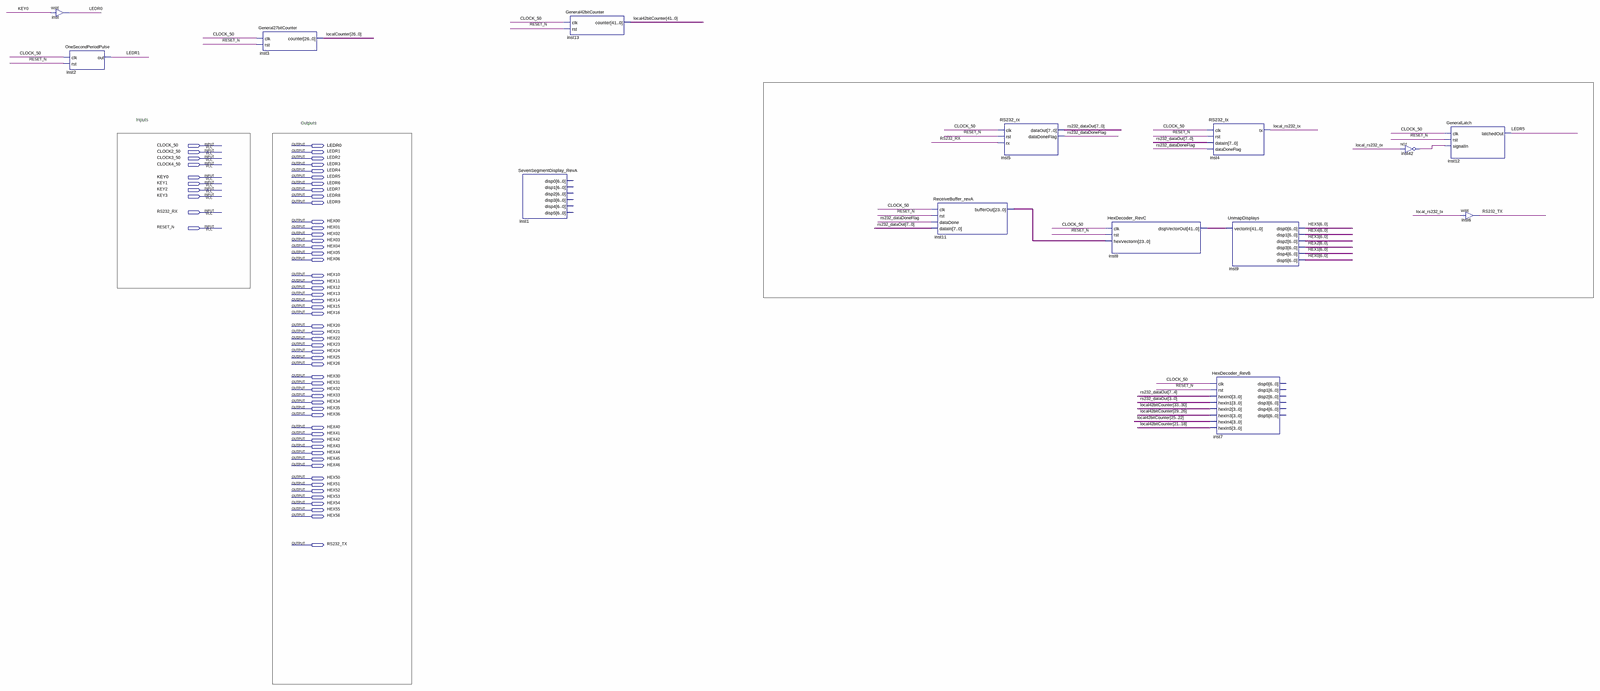
[diagram p0: schematic sheet, whole]
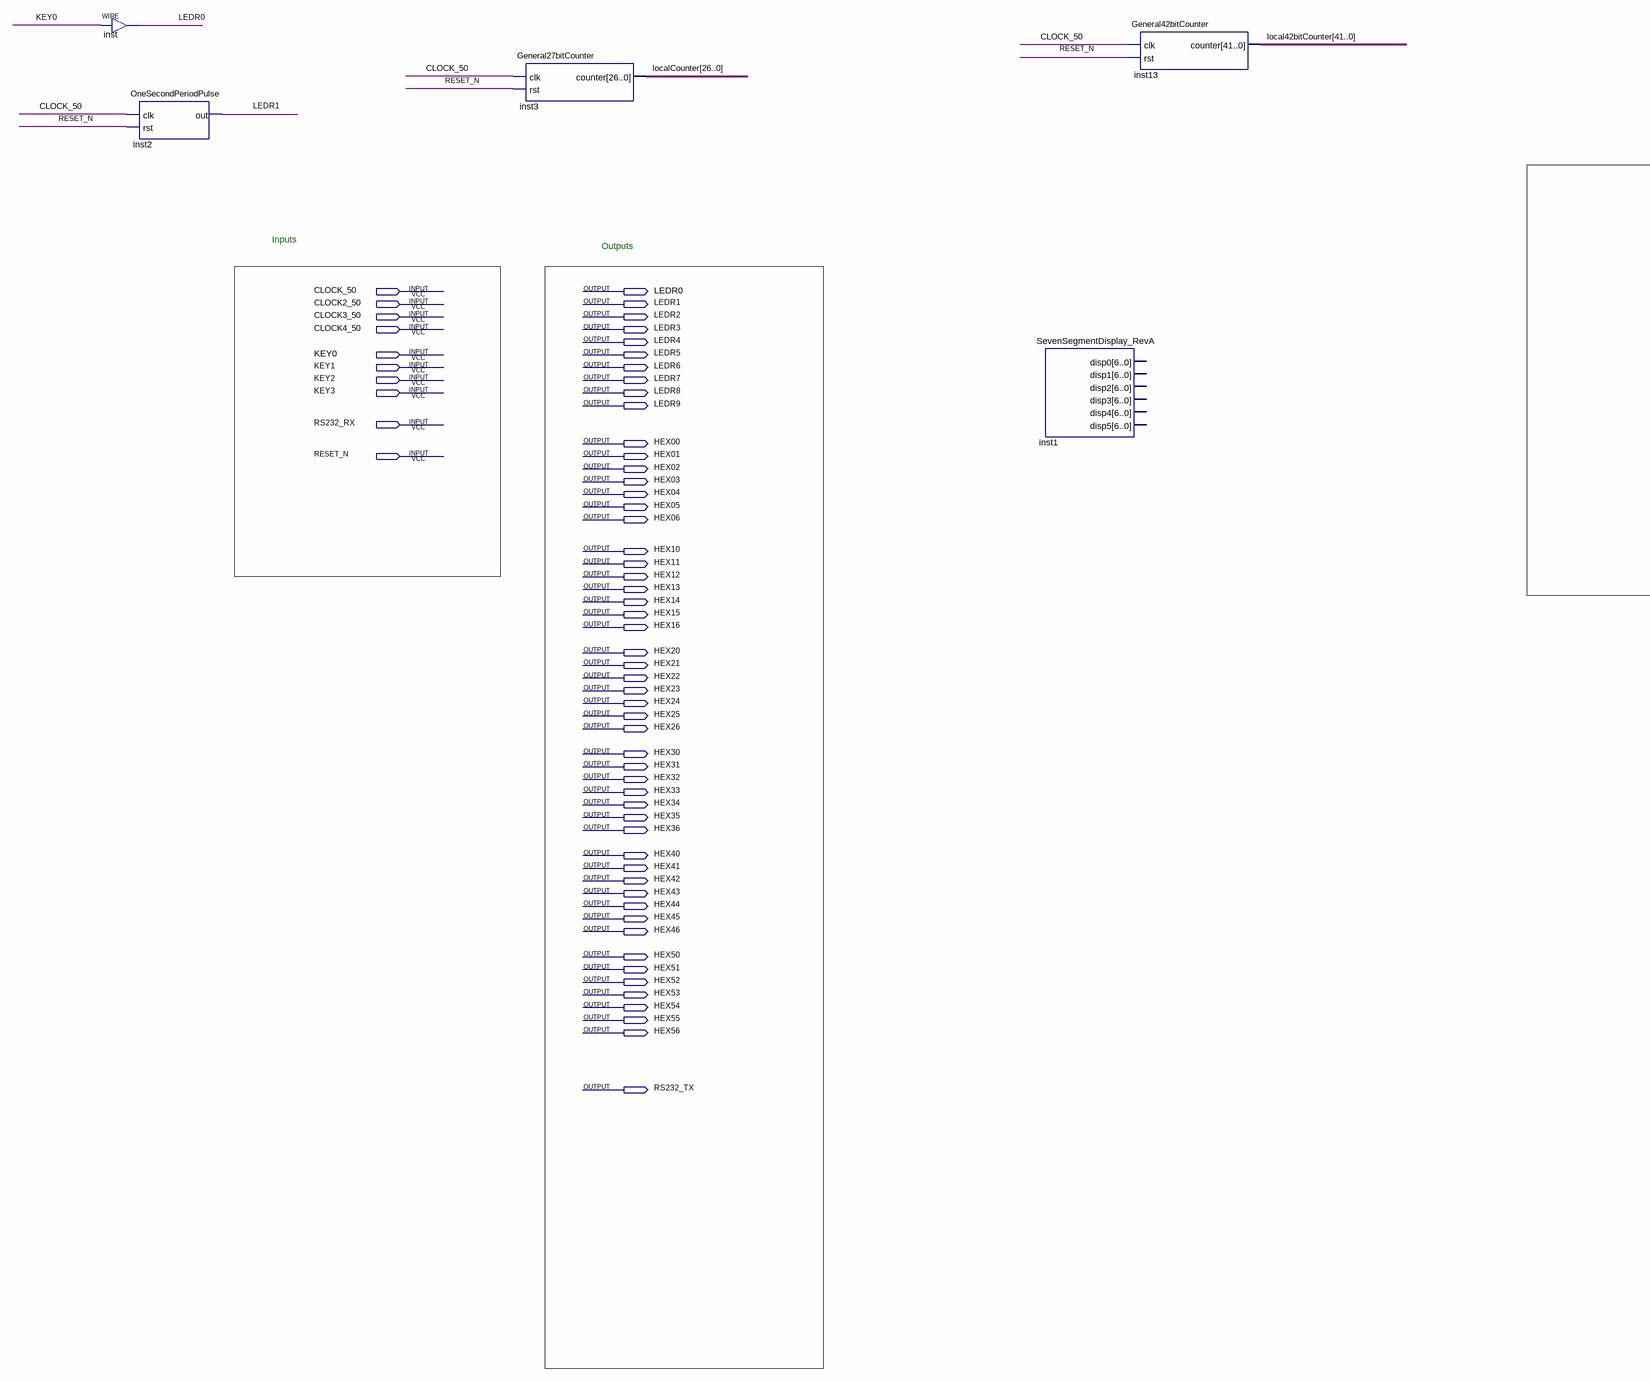
[diagram p1: schematic sheet, left part]
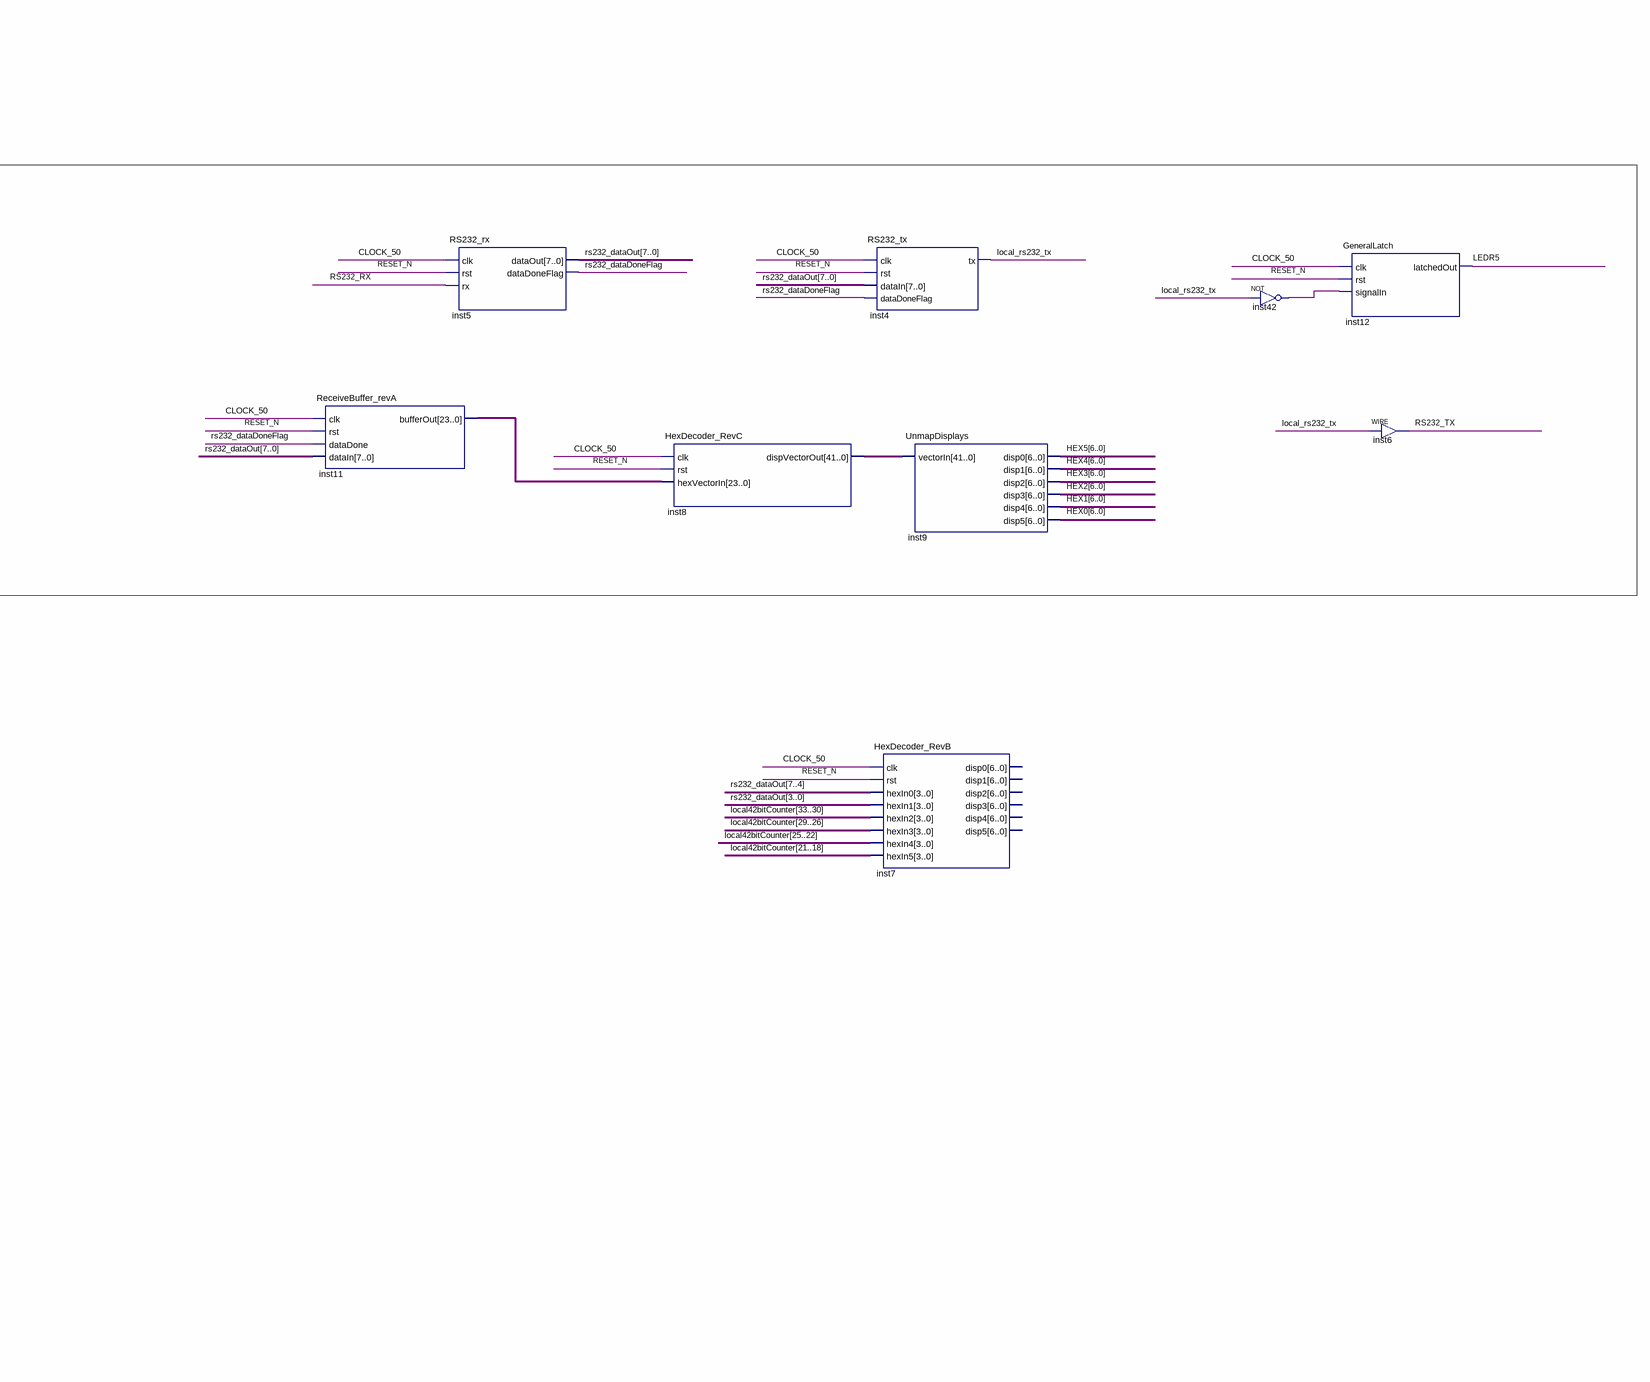
[diagram p2: schematic sheet, right part]
// Quartus schematic copper.bdf as structural Verilog: 14 symbols, 63 pins
module copper (
  input  CLOCK_50,
  input  CLOCK2_50,
  input  CLOCK3_50,
  input  CLOCK4_50,
  input  KEY0,
  input  KEY1,
  input  KEY2,
  input  KEY3,
  input  RS232_RX,
  input  RESET_N,
  output LEDR0,
  output LEDR1,
  output LEDR2,
  output LEDR3,
  output LEDR4,
  output LEDR5,
  output LEDR6,
  output LEDR7,
  output LEDR8,
  output LEDR9,
  output HEX00,
  output HEX01,
  output HEX02,
  output HEX03,
  output HEX04,
  output HEX05,
  output HEX06,
  output HEX10,
  output HEX11,
  output HEX12,
  output HEX13,
  output HEX14,
  output HEX15,
  output HEX16,
  output HEX20,
  output HEX21,
  output HEX22,
  output HEX23,
  output HEX24,
  output HEX25,
  output HEX26,
  output HEX30,
  output HEX31,
  output HEX32,
  output HEX33,
  output HEX34,
  output HEX35,
  output HEX36,
  output HEX40,
  output HEX41,
  output HEX42,
  output HEX43,
  output HEX44,
  output HEX45,
  output HEX46,
  output HEX50,
  output HEX51,
  output HEX52,
  output HEX53,
  output HEX54,
  output HEX55,
  output HEX56,
  output RS232_TX
);

  wire inst42_out, local_rs232_tx, rs232_dataDoneFlag;
  wire [7:0] rs232_dataOut;
  wire [23:0] inst11_bufferout;
  wire [26:0] localCounter;
  wire [41:0] inst8_dispvectorout, local42bitCounter;

  assign LEDR0 = KEY0;  // WIRE inst
  OneSecondPeriodPulse inst2 (.clk(CLOCK_50), .rst(RESET_N), .out(LEDR1));
  General27bitCounter inst3 (.clk(CLOCK_50), .rst(RESET_N), .counter(localCounter));
  SevenSegmentDisplay_RevA inst1 ();  // open: disp0, disp1, disp2, disp3, disp4, disp5
  General42bitCounter inst13 (.clk(CLOCK_50), .rst(RESET_N), .counter(local42bitCounter));
  ReceiveBuffer_revA inst11 (
    .clk(CLOCK_50), .rst(RESET_N), .dataDone(rs232_dataDoneFlag), .dataIn(rs232_dataOut),
    .bufferOut(inst11_bufferout));
  RS232_rx inst5 (
    .clk(CLOCK_50), .rst(RESET_N), .rx(RS232_RX), .dataOut(rs232_dataOut), .dataDoneFlag(rs232_dataDoneFlag));
  HexDecoder_RevC inst8 (
    .clk(CLOCK_50), .rst(RESET_N), .hexVectorIn(inst11_bufferout), .dispVectorOut(inst8_dispvectorout));
  RS232_tx inst4 (
    .clk(CLOCK_50), .rst(RESET_N), .dataIn(rs232_dataOut), .dataDoneFlag(rs232_dataDoneFlag),
    .tx(local_rs232_tx));
  HexDecoder_RevB inst7 (
    .clk(CLOCK_50), .rst(RESET_N), .hexIn0(rs232_dataOut[7:4]), .hexIn1(rs232_dataOut[3:0]),
    .hexIn2(local42bitCounter[33:30]), .hexIn3(local42bitCounter[29:26]), .hexIn4(local42bitCounter[25:22]),
    .hexIn5(local42bitCounter[21:18]));  // open: disp0, disp1, disp2, disp3, disp4, disp5
  UnmapDisplays inst9 (
    .vectorIn(inst8_dispvectorout), .disp0({HEX56, HEX55, HEX54, HEX53, HEX52, HEX51, HEX50}),
    .disp1({HEX46, HEX45, HEX44, HEX43, HEX42, HEX41, HEX40}),
    .disp2({HEX36, HEX35, HEX34, HEX33, HEX32, HEX31, HEX30}),
    .disp3({HEX26, HEX25, HEX24, HEX23, HEX22, HEX21, HEX20}),
    .disp4({HEX16, HEX15, HEX14, HEX13, HEX12, HEX11, HEX10}),
    .disp5({HEX06, HEX05, HEX04, HEX03, HEX02, HEX01, HEX00}));
  not inst42 (inst42_out, local_rs232_tx);
  GeneralLatch inst12 (.clk(CLOCK_50), .rst(RESET_N), .signalIn(inst42_out), .latchedOut(LEDR5));
  assign RS232_TX = local_rs232_tx;  // WIRE inst6

  // Notes on the sheet:
  //   Inputs
  //   Outputs
endmodule
